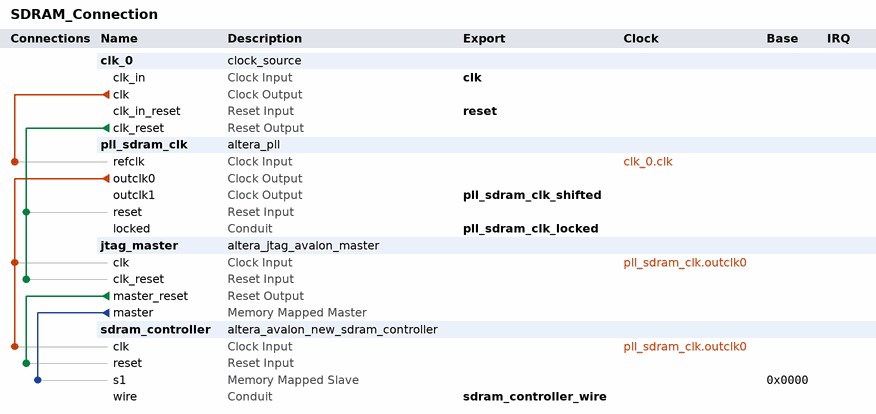
[diagram p0: system contents]
# Platform Designer (Qsys) system SDRAM_Connection, Cyclone V 5CSXFC6D6F31C6
# Parameters at their usual value, and those the tool derives, are not listed.
package require -exact qsys 20.1
create_system SDRAM_Connection
set_project_property DEVICE_FAMILY {Cyclone V}
set_project_property DEVICE 5CSXFC6D6F31C6

add_instance clk_0 clock_source 20.1
set_instance_parameter_value clk_0 clockFrequency 50000000

add_instance pll_sdram_clk altera_pll 20.1
set_instance_parameter_value pll_sdram_clk gui_device_speed_grade 1
set_instance_parameter_value pll_sdram_clk gui_number_of_clocks 2
set_instance_parameter_value pll_sdram_clk gui_operation_mode direct
set_instance_parameter_value pll_sdram_clk gui_output_clock_frequency0 143.0
set_instance_parameter_value pll_sdram_clk gui_output_clock_frequency1 143.0
set_instance_parameter_value pll_sdram_clk gui_phase_shift1 -3000
set_instance_parameter_value pll_sdram_clk gui_pll_mode {Integer-N PLL}
set_instance_parameter_value pll_sdram_clk gui_reference_clock_frequency 50.0
set_instance_parameter_value pll_sdram_clk gui_use_locked true

add_instance jtag_master altera_jtag_avalon_master 20.1

add_instance sdram_controller altera_avalon_new_sdram_controller 20.1
set_instance_parameter_value sdram_controller TAC 5.5
set_instance_parameter_value sdram_controller TRCD 15.0
set_instance_parameter_value sdram_controller TRFC 55.0
set_instance_parameter_value sdram_controller TRP 15.0
set_instance_parameter_value sdram_controller casLatency 2
set_instance_parameter_value sdram_controller columnWidth 8
set_instance_parameter_value sdram_controller dataWidth 32
set_instance_parameter_value sdram_controller generateSimulationModel false
set_instance_parameter_value sdram_controller initRefreshCommands 8
set_instance_parameter_value sdram_controller model single_Micron_MT48LC4M32B2_7_chip
set_instance_parameter_value sdram_controller numberOfBanks 4
set_instance_parameter_value sdram_controller numberOfChipSelects 1
set_instance_parameter_value sdram_controller powerUpDelay 100.0
set_instance_parameter_value sdram_controller refreshPeriod 7.8
set_instance_parameter_value sdram_controller rowWidth 13

# connections
add_connection clk_0.clk pll_sdram_clk.refclk clock
add_connection pll_sdram_clk.outclk0 jtag_master.clk clock
add_connection pll_sdram_clk.outclk0 sdram_controller.clk clock
add_connection clk_0.clk_reset jtag_master.clk_reset reset
add_connection clk_0.clk_reset pll_sdram_clk.reset reset
add_connection jtag_master.master_reset sdram_controller.reset reset
add_connection jtag_master.master sdram_controller.s1 avalon
set_connection_parameter_value jtag_master.master/sdram_controller.s1 baseAddress 0x0000

# exported interfaces
add_interface clk clock sink
set_interface_property clk EXPORT_OF clk_0.clk_in
add_interface pll_sdram_clk_locked conduit end
set_interface_property pll_sdram_clk_locked EXPORT_OF pll_sdram_clk.locked
add_interface pll_sdram_clk_shifted clock source
set_interface_property pll_sdram_clk_shifted EXPORT_OF pll_sdram_clk.outclk1
add_interface reset reset sink
set_interface_property reset EXPORT_OF clk_0.clk_in_reset
add_interface sdram_controller_wire conduit end
set_interface_property sdram_controller_wire EXPORT_OF sdram_controller.wire

set_interconnect_requirement {$system} qsys_mm.clockCrossingAdapter HANDSHAKE
set_interconnect_requirement {$system} qsys_mm.enableEccProtection FALSE
set_interconnect_requirement {$system} qsys_mm.insertDefaultSlave FALSE
set_interconnect_requirement {$system} qsys_mm.maxAdditionalLatency 1

save_system SDRAM_Connection.qsys
